# EAGLE design PK_MUV_L2 (EAGLE 9.1.3)
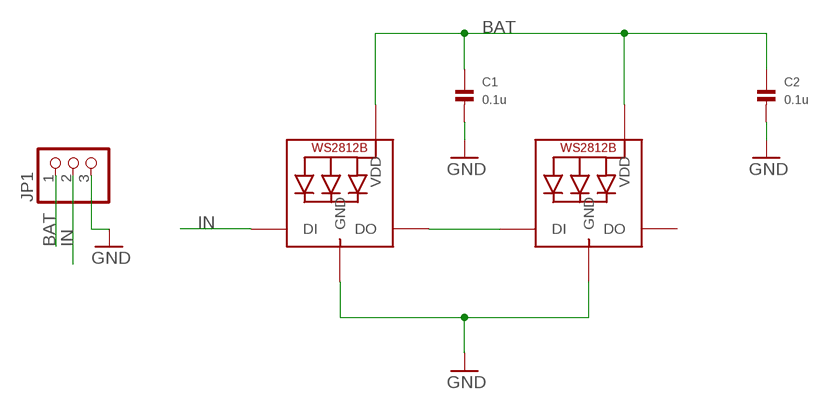
[diagram p0: schematic, sheet 1]

## Parts
C1  0.1u  CAP_CERAMIC1206  [1206]
C2  0.1u  CAP_CERAMIC1206  [1206]
JP1  HEADER-1X3  [1X03_OVAL]
LED1  WS2812B_5050N  [WS2812B-NARROW]
LED2  WS2812B_5050N  [WS2812B-NARROW]

## Nets
BAT [power]: C1.1 C2.1 JP1.1 LED1.1-VDD(VDD) LED2.1-VDD(VDD)
GND [power]: C1.2 C2.2 JP1.3 LED1.3-GND(GND) LED2.3-GND(GND)
IN: JP1.2 LED1.4-DIN(DI)
N$3: LED1.2-DOUT(DO) LED2.4-DIN(DI)
Unconnected: LED2.2-DOUT(DO)

## Library data of the parts
C1 C2 = microbuilder:CAP_CERAMIC: Ceramic Capacitors 0402 - 0402 Surface Mount Capacitors 16pF 50V 5% [Digikey: 445-4899-2-ND] 18pF 50V 5% [Digikey: 490-1281-2-ND] 22pF 50V 5% [Digikey: 490-1283-2-ND] 68pF 50V 5% [Digikey: 490-1289-2-ND] 0.1uF 10V 10% [Digikey: 490-1318-2-ND] 1.0uF 6.3V 10% [Digikey: 490-1320-2-ND] 0603 - 0603 Surface Mount Capacitors 16 pF 50V 5% [Digikey: 445-5051-2-ND] 22 pF 50V [Digikey: PCC220ACVTR-ND] 33 pF 50V 5% [Digikey: 490-1415-1-ND] 56pF 50V 5% [Digikey: 490-1421-1-ND] 220pF 50V 5% [Digikey: 445-1285-1-ND] 680 pF 50V 2200 pF 50V 5% C0G [Digikey: 445-1297-1-ND] 5600 pF 100V 5% X7R [Digikey: 478-3711-1-ND] 0.1 µF 25V 10% [Digikey: PCC2277TR-ND] 0.22 µF 16V 10% X7R [Digikey: 445-1318-1-ND] 1.0 µF 25V 10% [Digikey: 445-5146-2-ND] 0603 - RF Specific 3pF 250V +/-0.1pF RF [Digikey: 712-1347-1-ND] 18 pF 250V 5% [Digikey: 478-3505-1-ND or 712-1322-1-ND] 56 pF 250V 5% C0G RF [Digikey: 490-4867-1-ND] 68 pF 250V RF [Digikey: 490-4868-1-ND] 0805 - 0805 Surface Mount Capacitors 220 pF 250V 2% RF Ceramic Capacitor [Digikey: 712-1398-1-ND] 1000 pF 50V 2% NP0 Ceramic Capacitor [Digikey: 478-3760-1-ND] 0.1 µF 25V 10% Ceramic Capacitor [Digikey: PCC1828TR-ND] 1.0 µF 16V 10% Ceramic Capacitor[Digikey: 490-1691-2-ND] 10.0 µF 10V 10% Ceramic Capacitor[Digikey: 709-1228-1-ND] 10.0 uF 16V 10% Ceramic Capacitor [Digikey: 478-5165-2-ND] 47 uF 6.3V 20% Ceramic Capacitor [Digikey: 587-1779-1-ND or 399-5506-1-ND] 1206 - 1206 Surface Mount Capacitors 47uF 10V 20% Ceramic Capacitor [Digikey: 490-5528-1-ND or 399-5508-1-ND or 445-6010-1-ND] 100uF 6.3V -20%, +80% Y5V Ceramic Capacitor (Digikey: 490-4512-1-ND, Mouser: 81-GRM31CF50J107ZE1L)
JP1 = microbuilder:HEADER-1X3: PIN HEADER
LED1 LED2 = adafruit:WS2812B

## Net classes
0 default: width 0.3 mm, clearance 0.4 mm
1 power: width 1 mm, clearance 0.4 mm

## Board
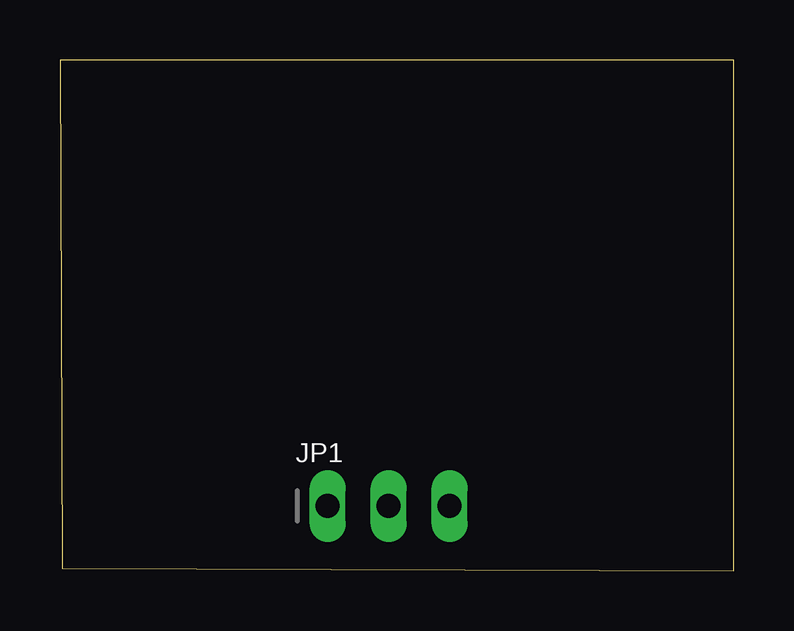
[diagram p1: board, top side]
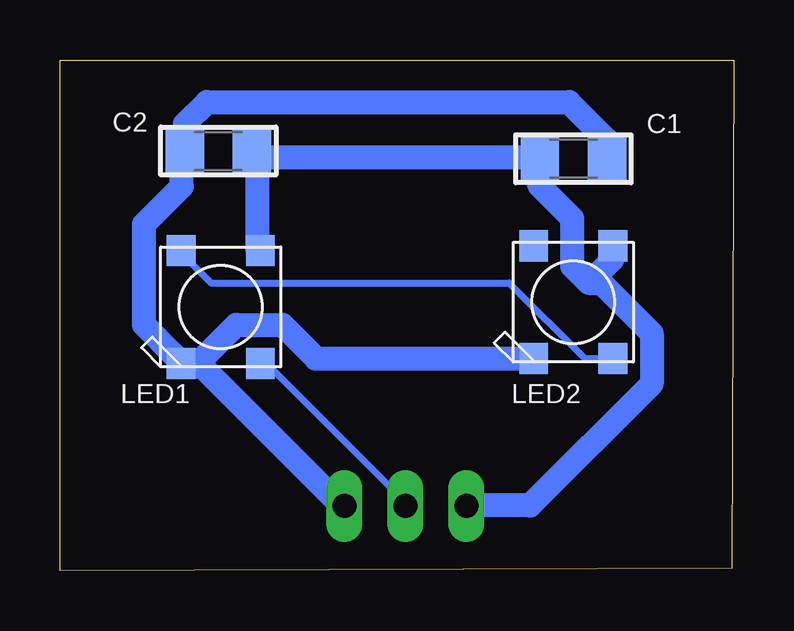
[diagram p2: board, bottom side, seen from below]

Size 28.1 x 21.3 mm. Coordinates in mm from the lower left corner, seen from the top.
Outline: 0.1,0.1 28.1,0 28.1,21.3 0,21.3 0.1,0.1
Copper layers (1*16): Top 0.035mm / dielectric 1.5mm / Bottom 0.035mm
Design rules "default *": minimum track width 6mil, minimum drill 0.35mm, track to track 0.4mm, track to pad 0.4mm, pad to pad 0.4mm, via to via 0.4mm, smd to smd 0.4mm, copper to edge 40mil, drill to drill 6mil, minimum pad ring 10mil, minimum via ring 8mil, stop-mask expansion 4mil, vias tented up to drill 0mil, thermal gap 10mil

### Footprints (pad centres in the part's own frame; a part is rotated, then mirrored left to right if it is on the bottom)
1206 = smd 1.6 x 1.8: 1 -1.4,0; 2 1.4,0
1X03_OVAL = drill 1 long: 1 -2.54,0; 2 0,0; 3 2.54,0
WS2812B-NARROW = smd 1.3 x 1.2: 1-VDD 2.35,-1.65; 2-DOUT 2.35,1.65; 3-GND -2.35,1.65; 4-DIN -2.35,-1.65

### Placement (x,y rotation side)
C1  6.69,17.18 0 bottom
C2  21.5,17.5 180 bottom
JP1  13.7,2.7 0 top
LED1  21.4,11 90 bottom
LED2  6.7,11.2 90 bottom

### Tracks (layer width: path | path; a pad name or v marks a point on that pad's centre or on a via)
BAT
  Bottom 1: LED1.1-VDD 19.88,13.4 19.88,17.25 20.05,17.43 C2.1 19.53,17.25 8.15,17.25 C1.1 8.09,16.81 8.26,16.65 8.11,16.06 6.75,14.7 6.75,12.7 6.05,12 | 6.05,12 5.52,12 3.43,9.9 3.43,7.8 8.5,2.73 11.12,2.73 JP1.1 | LED2.1-VDD 5.05,13 6.05,12
GND
  Bottom 1: C1.2 5.29,17.96 6.88,19.55 21.98,19.55 22.9,18.62 C2.2 23.03,17.08 23.03,16.03 24.6,14.45 24.6,10.25 23.38,9.03 LED1.3-GND 23.03,8.5 22.15,8.5 | 22.15,8.5 16.38,2.73 JP1.3 | LED2.3-GND 8.5,8.85 17.43,8.85 18.83,10.25 20.75,10.25 22.15,8.85 22.15,8.5
IN
  Bottom 0.3: LED1.4-DIN 19.7,8.5 19.35,8.5 13.57,2.73 JP1.2
N$3
  Bottom 0.3: LED2.4-DIN 5.17,8.85 6.22,8.85 9.38,12 21.8,12 23.03,13.22 LED1.2-DOUT